# Altium schematic sheet power_phase.schdoc: Phase
size A3; Revision: 1; SheetNumber: 2; SheetTotal: 2
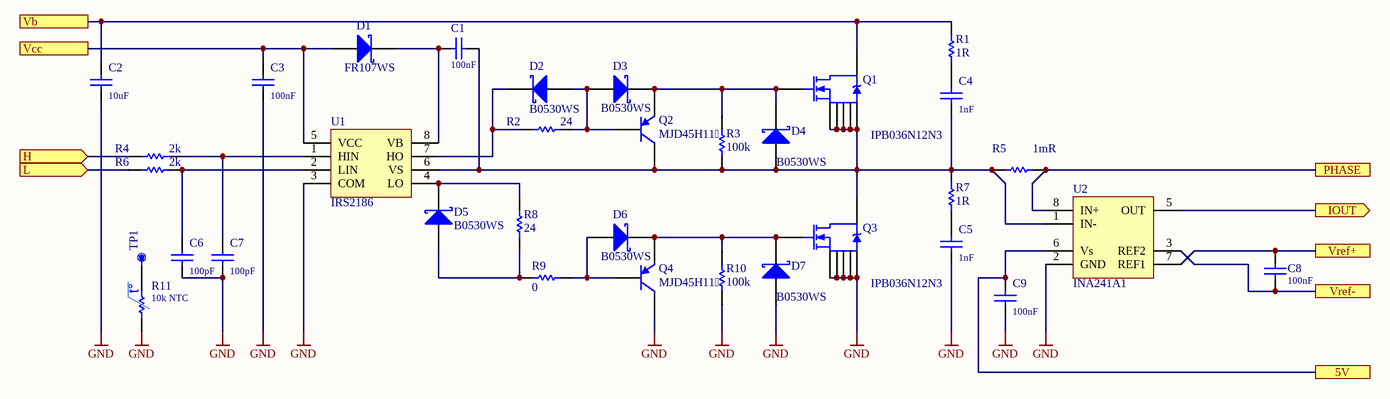
[diagram p0: power_phase.schdoc]

## Parts
C1  100nF  [C0805_L]
C2  10uF  [C2220]
C3  100nF  [C0603]
C4  1nF  [C0805]
C5  1nF  [C0805]
C6  100pF  [C0402]
C7  100pF  [C0402]
C8  100nF  [C0402]
C9  100nF  [C0402]
D1  FR107WS  [SOD-323]
D2  B0530WS  [SOD-323]
D3  B0530WS  [SOD-323]
D4  B0530WS  [SOD-323]
D5  B0530WS  [SOD-323]
D6  B0530WS  [SOD-323]
D7  B0530WS  [SOD-323]
Q1  IPB036N12N3  [TO-263-7]
Q2  MJD45H11  [TO-252AA]
Q3  IPB036N12N3  [TO-263-7]
Q4  MJD45H11  [TO-252AA]
R1  1R  [R1206]
R2  24  [R0603]
R3  100k  [R0805]
R4  2k  [R0603]
R5  1mR  [RES_CSS2H-3920R]
R6  2k  [R0603]
R7  1R  [R1206]
R8  24  [R0603]
R9  0  [R1206]
R10  100k  [R0805]
R11  10k NTC  [R0402]
TP1  (no value)  [TP2030_SMD]  (no BOM)
U1  IRS2186  [SO-8]
U2  INA241A1  [SOT-23-8]

## Ports
5V, H (in), IOUT (out), L (in), PHASE, Vb, Vcc, Vref+, Vref-

## Nets
GND: C2.1 C3.1 C5.1 C6.1 C7.1 C9.1 D7.1(A) Q3.2(S) Q3.3(S) Q3.5(S) Q3.6(S) Q3.7(S) Q4.2(C) R10.2 R11.2 U1.3(COM) U2.2(GND)
5V: C9.2 U2.6(Vs) ; port 5V
H: R4.2 ; port H
IOUT: U2.5(OUT) ; port IOUT
L: R6.2 ; port L
PHASE: R5.2 U2.8(IN+) ; port PHASE
Vb: C2.2 Q1.4(D) R1.2 ; port Vb
Vcc: C3.2 D1.1(A) U1.5(VCC) ; port Vcc
Vref+: C8.2 U2.7(REF1) ; port Vref+
Vref-: C8.1 U2.3(REF2) ; port Vref-
NetC1_1: C1.1 D1.2(K) U1.8(VB)
NetC1_2: C1.2 C4.1 D4.1(A) Q1.2(S) Q1.3(S) Q1.5(S) Q1.6(S) Q1.7(S) Q2.2(C) Q3.4(D) R3.2 R5.1 R7.2 U1.6(VS) U2.1(IN-)
NetC4_2: C4.2 R1.1
NetC5_2: C5.2 R7.1
NetC6_2: C6.2 R6.1 U1.2(LIN)
NetC7_2: C7.2 R4.1 U1.1(HIN)
NetD2_1: D2.1(A) D3.1(A) Q2.1(B) R2.1
NetD2_2: D2.2(K) R2.2 U1.7(HO)
NetD3_2: D3.2(K) D4.2(K) Q1.1(G) Q2.3(E) R3.1
NetD5_1: D5.1(A) R8.1 R9.2
NetD5_2: D5.2(K) R8.2 U1.4(LO)
NetD6_1: D6.1(A) Q4.1(B) R9.1
NetD6_2: D6.2(K) D7.2(K) Q3.1(G) Q4.3(E) R10.1
NetR11_1: R11.1 TP1.1

## Notes on the sheet
- (in symbol RES) t°

## Library data of the parts
C1 = CAP: 100n 0805
C2 = CAP: 10uF 100V 2220
C3 = CAP: 100n 0603
C4 C5 = CAP: 1nF 100V 0805
C6 C7 = CAP: 100pF 0402
C8 C9 = CAP: 100nF 0402
D1 = Diode 10TQ035_1
D2-D7 = Diode 10TQ035_1: FR107WS
Q1 Q3 = NMOS-2: IPB036N12N3GATMA1
Q2 Q4 = PNP
R1 R7 = Res1: 1R 1206
R2 R8 = Res1: 24R 0603
R3 R10 = Res1: 100k 0805
R4 R6 = Res1: 2k 0603
R5 = Res1
R9 = Res1: 0R 2512
R11 = RES
TP1 = TP_Dup1
U1 = IRS2186: IR2186